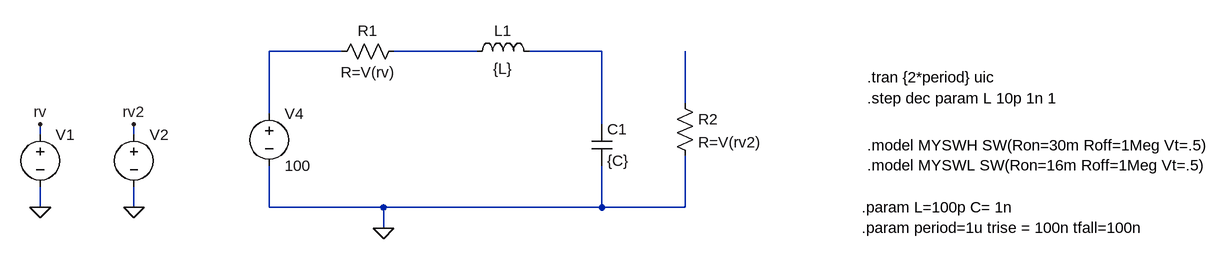
[diagram p0: schematic ringing.asc]
ringing.asc, the LTspice schematic file:
Version 4
SHEET 1 1904 1156
WIRE -544 -32 -656 -32
WIRE -336 -32 -464 -32
WIRE -144 -32 -256 -32
WIRE -16 48 -16 -32
WIRE -656 64 -656 -32
WIRE -144 80 -144 -32
WIRE -1008 96 -1008 80
WIRE -864 96 -864 80
WIRE -1008 208 -1008 176
WIRE -864 208 -864 176
WIRE -656 208 -656 144
WIRE -480 208 -656 208
WIRE -144 208 -144 144
WIRE -144 208 -480 208
WIRE -16 208 -16 128
WIRE -16 208 -144 208
WIRE -480 240 -480 208
FLAG -480 240 0
FLAG -1008 208 0
FLAG -1008 80 rv
FLAG -864 208 0
FLAG -864 80 rv2
SYMBOL ind -352 -16 R270
WINDOW 0 32 56 VTop 2
WINDOW 3 5 56 VBottom 2
SYMATTR InstName L1
SYMATTR Value {L}
SYMBOL cap -160 80 R0
SYMATTR InstName C1
SYMATTR Value {C}
SYMBOL res -560 -16 R270
WINDOW 0 32 56 VTop 2
WINDOW 3 0 56 VBottom 2
SYMATTR InstName R1
SYMATTR Value R=V(rv)
SYMBOL voltage -656 48 R0
WINDOW 123 0 0 Left 2
WINDOW 39 0 0 Left 2
SYMATTR InstName V4
SYMATTR Value 100
SYMBOL res -32 32 R0
SYMATTR InstName R2
SYMATTR Value R=V(rv2)
SYMBOL voltage -1008 80 R0
WINDOW 123 0 0 Left 2
WINDOW 39 0 0 Left 2
WINDOW 3 24 96 Invisible 2
SYMATTR Value PULSE(100k 10m {period/2} {trise} {tfall} {period/2} {period})
SYMATTR InstName V1
SYMBOL voltage -864 80 R0
WINDOW 123 0 0 Left 2
WINDOW 39 0 0 Left 2
WINDOW 3 24 96 Invisible 2
SYMATTR Value PULSE(10m 100k {period/2} {trise} {tfall} {period/2} {period})
SYMATTR InstName V2
TEXT 264 8 Left 2 !.tran {2*period} uic
TEXT 264 112 Left 2 !.model MYSWH SW(Ron=30m Roff=1Meg Vt=.5)\n.model MYSWL SW(Ron=16m Roff=1Meg Vt=.5)
TEXT 256 208 Left 2 !.param L=100p C= 1n\n.param period=1u trise = 100n tfall=100n
TEXT 264 40 Left 2 !.step dec param L 10p 1n 1

The netlist it stands for:
* ringing.asc
L1 N002 N003 {L}
C1 N003 0 {C}
R1 N001 N002 R=V(rv)
V4 N001 0 100
R2 N004 0 R=V(rv2)
V1 rv 0 PULSE(100k 10m {period/2} {trise} {tfall} {period/2} {period})
V2 rv2 0 PULSE(10m 100k {period/2} {trise} {tfall} {period/2} {period})
.tran {2*period} uic
.model MYSWH SW(Ron=30m Roff=1Meg Vt=.5)
.model MYSWL SW(Ron=16m Roff=1Meg Vt=.5)
.param L=100p C= 1n
.param period=1u trise = 100n tfall=100n
.step dec param L 10p 1n 1
.backanno
.end